# EAGLE schematic emonVs.voltage_sensor_3-wire_220V_DRAFT_EXAMPLE (EAGLE 8.2.2)
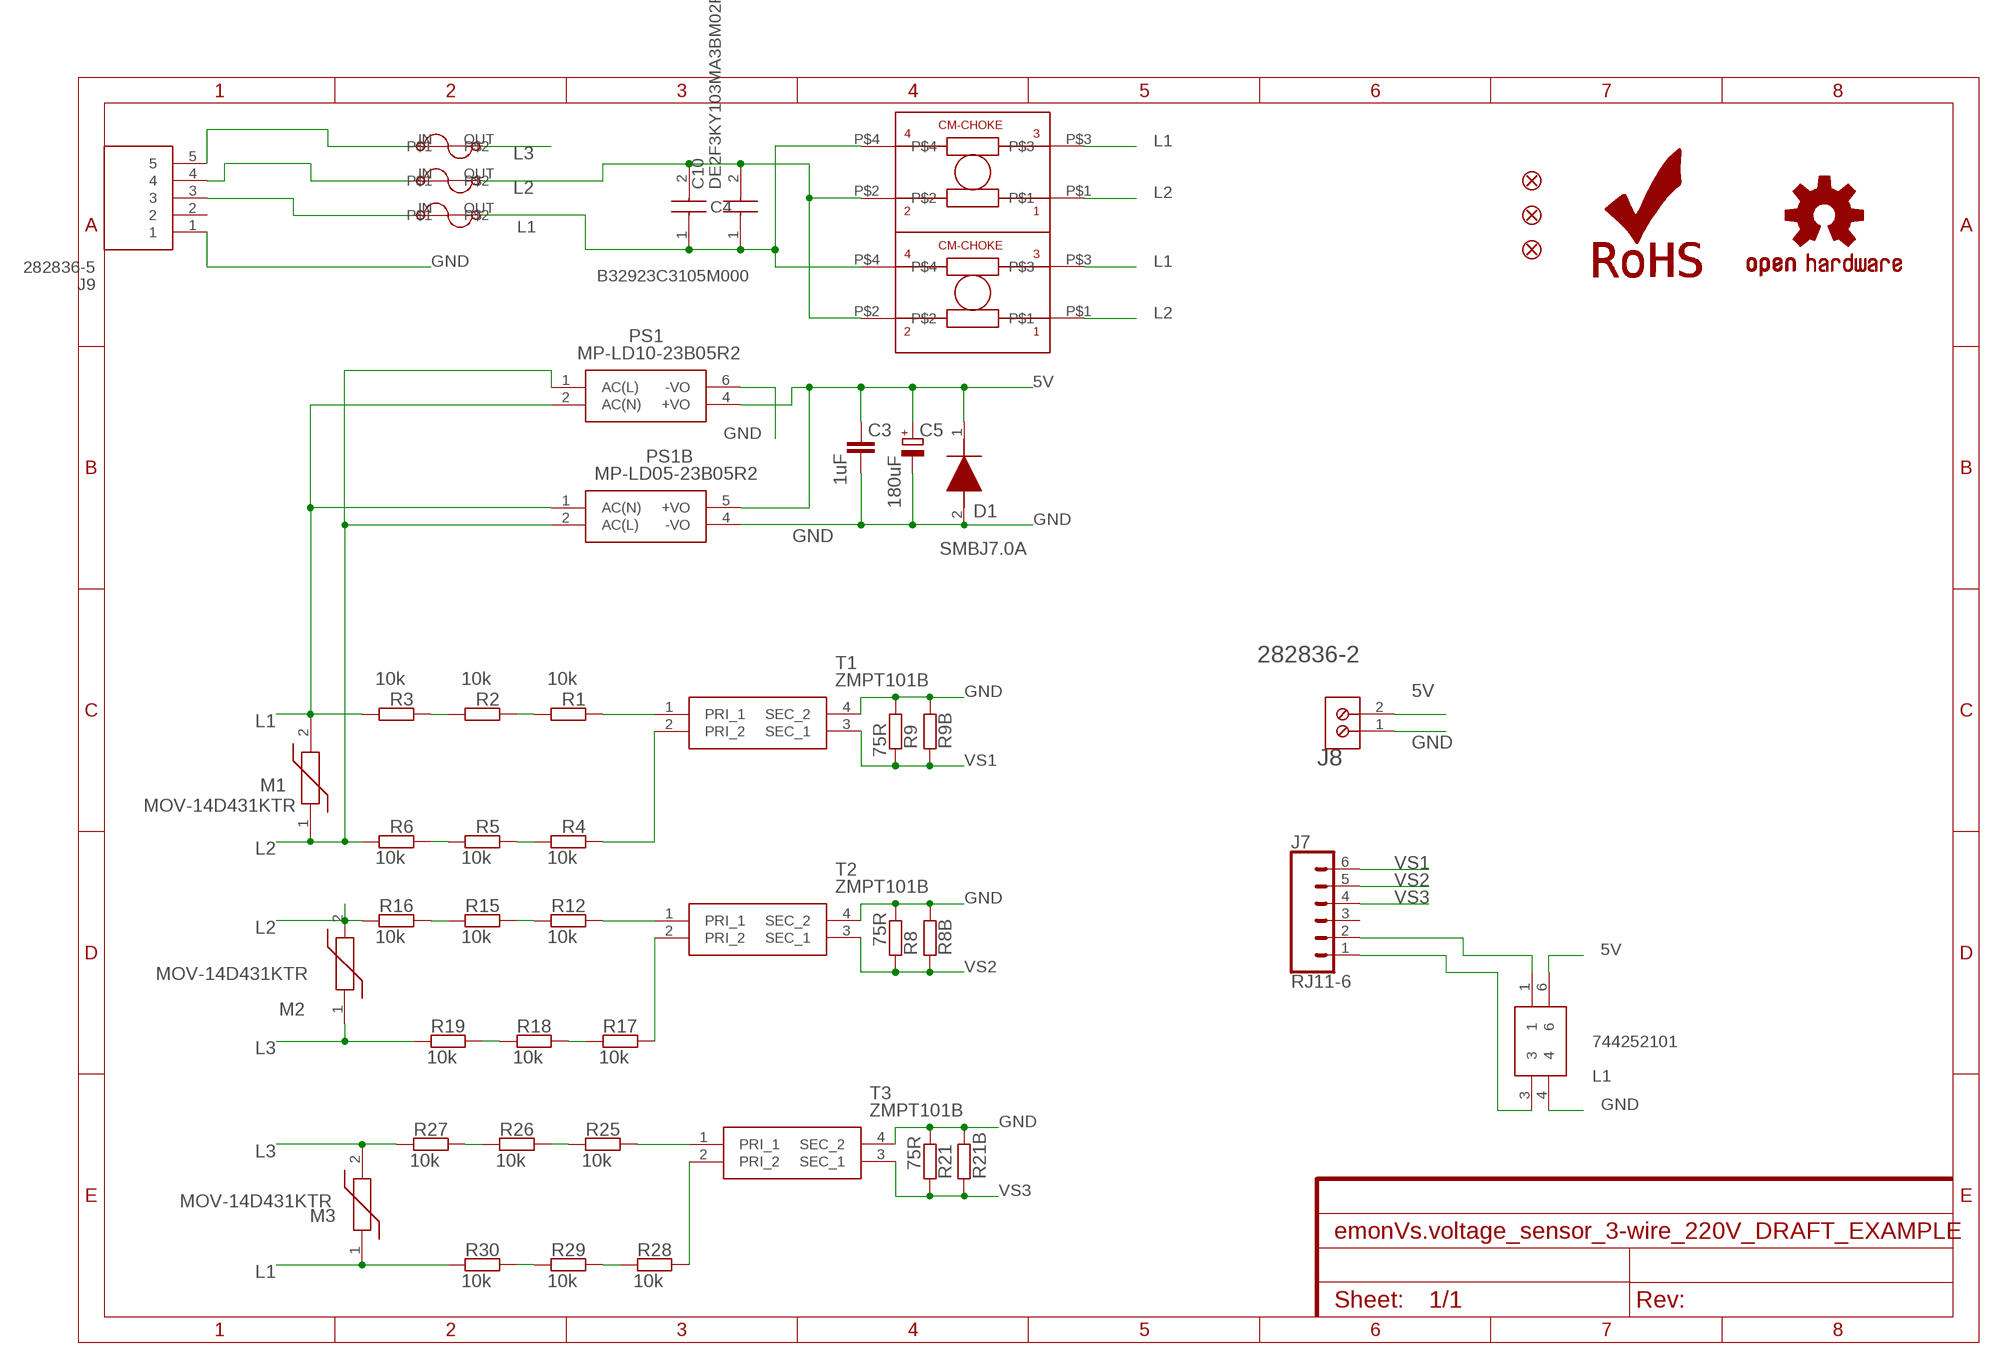
[diagram p0: schematic, sheet 1]

## Parts
C3  1uF  C-EUC0603  [C0603]
C4  B32923C3105M000  [B32923C_(26.5_X_12)]
C5  180uF  CPOL-EUC  [PANASONIC_C]
C10  DE2F3KY103MA3BM02F  [DE2F3KY103MA3BM02F]
D1  SMBJ7.0A  [DIOM5336X244N]
F1  2A/250V  BEL1AFUSE  [BELFUSE1A]
F2  2A/250V  BEL1AFUSE  [BELFUSE1A]
F3  2A/250V  BEL1AFUSE  [BELFUSE1A]
FD1  FIDUCIAL1X2  [FIDUCIAL-1X2]
FD2  FIDUCIAL1X2  [FIDUCIAL-1X2]
FD3  FIDUCIAL1X2  [FIDUCIAL-1X2]
J7  RJ11-6  [RJ11-6]
J8  TE_CONNECTIVITY_282836-2TE_CONNECTIVITY_282836-2_0_0  [TE_CONNECTIVITY_282836-2_0]
J9  282836-5  [2828365]
L1  744252101  [744252101]
LOGO1  ROHS_LOGO  [ROHS_LOGO_0.18_IN]
LOGO2  OSHW-LOGOS-COPPER  [OSHW-LOGO-S_COPPER]
M1  MOV-14D431KTR  [MOV14D431KTR]
M2  MOV-14D431KTR  [MOV14D431KTR]
M3  MOV-14D431KTR  [MOV14D431KTR]
PS1  MP-LD10-23B05R2  MP-LD10-23B12R2  [MPLD1023B12R2]
PS1B  MP-LD05-23B05R2  MP-LD05-23B03R2  [MPLD0523B03R2]
R1  10k  R-EU_R0603  [R0603]
R2  10k  R-EU_R0603  [R0603]
R3  10k  R-EU_R0603  [R0603]
R4  10k  R-EU_R0603  [R0603]
R5  10k  R-EU_R0603  [R0603]
R6  10k  R-EU_R0603  [R0603]
R8  75R  R-EU_R0603  [R0603]
R8B  R-EU_0204/7  [0204/7]
R9  75R  R-EU_R0603  [R0603]
R9B  R-EU_0204/7  [0204/7]
R12  10k  R-EU_R0603  [R0603]
R15  10k  R-EU_R0603  [R0603]
R16  10k  R-EU_R0603  [R0603]
R17  10k  R-EU_R0603  [R0603]
R18  10k  R-EU_R0603  [R0603]
R19  10k  R-EU_R0603  [R0603]
R21  75R  R-EU_R0603  [R0603]
R21B  R-EU_0204/7  [0204/7]
R25  10k  R-EU_R0603  [R0603]
R26  10k  R-EU_R0603  [R0603]
R27  10k  R-EU_R0603  [R0603]
R28  10k  R-EU_R0603  [R0603]
R29  10k  R-EU_R0603  [R0603]
R30  10k  R-EU_R0603  [R0603]
T1  ZMPT101B  [ZMPT101B]
T2  ZMPT101B  [ZMPT101B]
T3  ZMPT101B  [ZMPT101B]
U$1  47mH  RN114-0.3-02-47M  [RN114-0.3-02-47M]
U$1B  RN214-0.3-02-47M  [RN214-0.3-02-47M]

## Nets
5V: C3.1 C5.+ D1.1(K) J8.2 L1.6 PS1.4(+VO) PS1B.5(+VO)
GND: C3.2 C5.- D1.2(A) J8.1 J9.1 L1.4 PS1.6(-VO) PS1B.4(-VO) R8.2 R8B.2 R9.2 R9B.2 R21.2 R21B.2 T1.4(SEC_2) T2.4(SEC_2) T3.4(SEC_2)
L1: C4.1 C10.1 F1.OUT M1.2 M3.1 PS1.2(AC(N)) PS1B.1(AC(N)) R3.2 R30.2 U$1.P$3 U$1.P$4 U$1B.P$3 U$1B.P$4
L2: F2.OUT M1.1 M2.2 PS1.1(AC(L)) PS1B.2(AC(L)) R6.2 R16.2 U$1.P$1 U$1B.P$1
L3: F3.OUT M2.1 M3.2 R19.2 R27.2
N$1: R1.1 T1.1(PRI_1)
N$2: R4.1 T1.2(PRI_2)
N$3: R1.2 R2.1
N$4: R4.2 R5.1
N$5: R5.2 R6.1
N$6: R2.2 R3.1
N$7: F1.IN J9.3
N$8: F2.IN J9.4
N$10: R12.1 T2.1(PRI_1)
N$11: R17.1 T2.2(PRI_2)
N$12: R12.2 R15.1
N$13: R17.2 R18.1
N$14: R18.2 R19.1
N$15: R15.2 R16.1
N$16: F3.IN J9.5
N$18: J7.2 L1.1
N$19: R25.1 T3.1(PRI_1)
N$20: R28.1 T3.2(PRI_2)
N$21: R25.2 R26.1
N$22: R28.2 R29.1
N$23: R29.2 R30.1
N$24: R26.2 R27.1
N$27: J7.1 L1.3
N$29: C4.2 C10.2 U$1.P$2 U$1B.P$2
VS1: J7.6 R9.1 R9B.1 T1.3(SEC_1)
VS2: J7.5 R8.1 R8B.1 T2.3(SEC_1)
VS3: J7.4 R21.1 R21B.1 T3.3(SEC_1)
Unconnected: J7.3 J9.2

## Library data of the parts
C3 = resistor:C-EU: CAPACITOR, European symbol
C4 = B32923C3105M000:B32923C3105M000: EPCOS - B32923C3105M000 - Safety Capacitor, 1 ?F, X2, B32923C Series, 305 V, Metallized PP Source: Datasheet <https://product.tdk.com/system/files/dam/doc/product/capacitor/film/emi/data_sheet/20/20/db/fc_2009/x2_b32921_928.pdf>; ARROW_PART_NUMBER: B32923C3105M000; ARROW_PRICE-STOCK: https://www.arrow.com/en/products/b32923c3105m000/epcos-tdk; DESCRIPTION: EPCOS - B32923C3105M000 - Safety Capacitor, 1 ?F, X2, B32923C Series, 305 V, Metallized PP; HEIGHT: mm; MANUFACTURER_NAME: TDK; MANUFACTURER_PART_NUMBER: B32923C3105M000
C5 = rcl:CPOL-EU: POLARIZED CAPACITOR, European symbol; SPICEPREFIX: C
C10 = DE2F3KY103MA3BM02F:DE2F3KY103MA3BM02F: Murata Single Layer Ceramic Capacitor SLCC 10nF 250Vrms +/-20% F Dielectric DE2 Series +85C Max Op. Temp. Source: Datasheet <https://psearch.en.murata.com/capacitor/product/DE2F3KY103MA3BM02F.html>; ARROW_PART_NUMBER: DE2F3KY103MA3BM02F; ARROW_PRICE-STOCK: https://www.arrow.com/en/products/de2f3ky103ma3bm02f/murata-manufacturing; DESCRIPTION: Murata Single Layer Ceramic Capacitor SLCC 10nF 250Vrms +/-20% F Dielectric DE2 Series +85C Max Op. Temp.; HEIGHT: 17mm; MANUFACTURER_NAME: Murata Electronics; MANUFACTURER_PART_NUMBER: DE2F3KY103MA3BM02F; MOUSER_PART_NUMBER: 81-DE2F3KY103MA3BM2F; MOUSER_PRICE-STOCK: https://www.mouser.co.uk/ProductDetail/Murata-Electronics/DE2F3KY103MA3BM02F?qs=coxMWmu44UCpS%2FqDCKay7w%3D%3D
D1 = SMBJ7.0A:SMBJ7.0A: TVS, SMD, 600W, 7V HY Electronic Corp SMBJ7.0A Uni-Directional TVS Diode, 600 (Min.)W peak, 2-Pin SMB Source: Datasheet; DESCRIPTION: TVS, SMD, 600W, 7V HY Electronic Corp SMBJ7.0A Uni-Directional TVS Diode, 600 (Min.)W peak, 2-Pin SMB; HEIGHT: 2.44mm; MANUFACTURER_NAME: HY Electronic Corp; MANUFACTURER_PART_NUMBER: SMBJ7.0A
F1-F3 = Qxd:BEL1AFUSE
FD1-FD3 = SparkFun-Aesthetics:FIDUCIAL: Fiducial Alignment Points Point-of-reference for pick-and-place machines and other optical instruments.
J7 = SparkFun-Connectors:RJ11-6: RJ11 Jack - 6 pin Commonly found on CAT3 devices and some Microchip programmers. Here is the connector we sell at SparkFun: RJ11 6-Pin Connector <https://www.sparkfun.com/products/132> (PRT-00132) Datasheet <http://www.sparkfun.com/datasheets/Prototyping/Connectors/RJ11-Datasheet.pdf> It is used on this SparkFun product: SparkFun Weather Shield <https://www.sparkfun.com/products/12081> (DEV-12081) Weather Meters <https://www.sparkfun.com/products/8942> (SEN-08942); PROD_ID: CONN-08590; SF_ID: PRT-00132; VALUE: RJ11
J8 = TE Connectivity - 282836-2:TE_CONNECTIVITY_282836-2: CN-1P-F-TB2; 3D_MODEL: 282836-2.pdf; CATEGORY: Connectors,Interconnects; CIIVA_IDS: 751464; CLAMP_MATERIAL___PLATING: Brass-NickelPlated; COLOR: Green; CONTACT_MATERIAL___PLATING: Brass-TinPlated; CURRENT: 13.5A; DATASHEET_URL: http://www.te.com.cn/commerce/DocumentDelivery/DDEController?Action=showdoc&DocId=Catalog+Section%7F1308389_EUROSTYLE_TERMINAL_BLOCKS%7F0607%7Fpdf%7FEnglish%7FENG_CS_1308389_EUROSTYLE_TERMINAL_BLOCKS_0607.pdf%7F282836-2; DYNAMIC_CATALOG: BuchananSeries; FAMILY: TerminalBlocks-WiretoBoard; FEATURED_PRODUCT: EurostyleTerminalBlockConnectors; FEATURES: Interlocking(Side); FOOTPRINT_VARIANT_NAME_0: Manufacturer Recommended; HOUSING_MATERIAL: Polyamide(PA66),Nylon6/6; IMPORTED: yes; IMPORTED_FROM: vault; IMPORT_TS: 1521863485; MANUFACTURER_URL: http://www.te.com; MATING_ORIENTATION: HorizontalwithBoard; MF: TE Connectivity; MOUNTING_TYPE: ThroughHole; MPN: 282836-2; NUMBER_OF_LEVELS: 1; OTHER_NAMES: 5ULV-02BA98076; PACKAGE_DESCRIPTION: Female Header, Pitch 5 mm, 1 x 2 Position, Height 10 mm, Tail Length 3.5 mm; PACKAGE_REFERENCE: THD; PACKAGING: Bulk; PITCH: 0.197"(5.00mm); POSITIONS_PER_LEVEL: 2; PREFIX: J; PRODUCT_TRAINING_MODULES: Wire-to-BoardEurostyleTerminalBlocks; RELEASE_DATE: 1509504648; ROHS_INFORMATION: 282836-2StatementofCompliance; SCREW_MATERIAL___PLATING: Brass-NickelPlated; SCREW_THREAD: M3; SERIES: Buchanan; STANDARD_PACKAGE: 300; TORQUE___SCREW: 0.68Nm(6Lb-In); VAULT_GUID: C9495783-FFFC-46B6-B95E-4CE97DFAD08E; VAULT_REVISION: DF47BFDD-E559-4BFA-862A-02055DA5A464; VOLTAGE: 300V; WIRE_GAUGE: 16-30AWG; WIRE_TERMINATION: Screw-RisingCageClamp
J9 = 282836-5:282836-5: TERMI-BLOK PCB MOUNT 90 5P. Source: Datasheet <https://www.te.com/commerce/DocumentDelivery/DDEController?Action=srchrtrv&DocNm=1-1773458-1_EURO_STYLE_QRG&DocType=Data Sheet&DocLang=English&PartCntxt=282836-5&DocFormat=pdf>; ARROW_PART_NUMBER: 282836-5; ARROW_PRICE-STOCK: https://www.arrow.com/en/products/282836-5/te-connectivity?region=nac; DESCRIPTION: TERMI-BLOK PCB MOUNT 90 5P.; HEIGHT: 10.2mm; MANUFACTURER_NAME: TE Connectivity; MANUFACTURER_PART_NUMBER: 282836-5; MOUSER_PART_NUMBER: 571-2828365; MOUSER_PRICE-STOCK: https://www.mouser.co.uk/ProductDetail/TE-Connectivity/282836-5?qs=A%252Bip%252BNCYi6PWM9nOrDokEg%3D%3D
L1 = 744252101:744252101: Common Mode Choke WE-SL3 2x100uH 0.5A Wurth WE-SL3 Series Wire-wound SMD Inductor with a Ferrite Core, 100 uH +50/-30 Bifilar Winding 500mA Idc Source: Datasheet <https://datasheet.datasheetarchive.com/originals/distributors/Datasheets_SAMA/813b8c68731e2e4ca9c504a5a5705204.pdf>; DESCRIPTION: Common Mode Choke WE-SL3 2x100uH 0.5A Wurth WE-SL3 Series Wire-wound SMD Inductor with a Ferrite Core, 100 uH +50/-30 Bifilar Winding 500mA Idc; HEIGHT: 2.5mm; MANUFACTURER_NAME: Wurth Elektronik; MANUFACTURER_PART_NUMBER: 744252101; MOUSER_PART_NUMBER: 710-744252101; MOUSER_PRICE-STOCK: https://www.mouser.co.uk/ProductDetail/Wurth-Elektronik/744252101?qs=T3oQrply3y%2FhsB6zILUctg%3D%3D
LOGO1 = SparkFun-Aesthetics:ROHS_LOGO: Restriction of Hazardous Substances (RoHS) Logo Logo for RoHS-certified hardware.
LOGO2 = SparkFun-Aesthetics:OSHW-LOGO: Open-Source Hardware (OSHW) Logo This logo indicates the piece of hardware it is found on incorporates a OSHW license and/or adheres to the definition of open source hardware found here: http://freedomdefined.org/OSHW
M1-M3 = MOV-14D431KTR:MOV-14D431KTR: Var MOV 275VAC/350VDC 4500A 430V Thru-Hole Radial T/R Source: Datasheet <https://componentsearchengine.com/Datasheets/2/MOV-14D431KTR.pdf>; ARROW_PART_NUMBER: MOV-14D431KTR; ARROW_PRICE-STOCK: https://www.arrow.com/en/products/mov-14d431ktr/bourns; DESCRIPTION: Var MOV 275VAC/350VDC 4500A 430V Thru-Hole Radial T/R; HEIGHT: 20mm; MANUFACTURER_NAME: Bourns; MANUFACTURER_PART_NUMBER: MOV-14D431KTR; MOUSER_PART_NUMBER: 652-MOV-14D431KTR; MOUSER_PRICE-STOCK: https://www.mouser.co.uk/ProductDetail/Bourns/MOV-14D431KTR?qs=CQ3B1E%252BbPs0ZvUvqcBsPRw%3D%3D
PS1 = MP-LD10-23B12R2:MP-LD10-23B12R2: MULTICOMP PRO - MP-LD10-23B05R2 - AC/DC PCB Mount Power Supply (PSU), 100 to 430VDC, ITE, Household, Medical & Transformers, 5V Output Source: Datasheet <https://componentsearchengine.com/Datasheets/2/MP-LD10-23B05R2.pdf>; DESCRIPTION: MULTICOMP PRO - MP-LD10-23B12R2 - AC/DC PCB Mount Power Supply (PSU), 100 to 430VDC, ITE, Household, Medical & Transformers, 1 Output; HEIGHT: 21.5mm; MANUFACTURER_NAME: MULTICOMP; MANUFACTURER_PART_NUMBER: MP-LD10-23B05R2
PS1B = MP-LD05-23B03R2:MP-LD05-23B03R2: POWER SUPPLY, AC-DC, 3.3V, 1.515A Source: Datasheet <https://www.farnell.com/datasheets/3167202.pdf>; DESCRIPTION: POWER SUPPLY, AC-DC, 3.3V, 1.515A; HEIGHT: 18.1mm; MANUFACTURER_NAME: MULTICOMP; MANUFACTURER_PART_NUMBER: MP-LD05-23B03R2
R1-R6 R8 R8B R9 R9B R12 R15-R19 R21 R21B R25-R30 = rcl:R-EU_: RESISTOR, European symbol
T1-T3 = ZMPT101B:ZMPT101B: Current-type Voltage Transformer Source: Datasheet; DESCRIPTION: Current-type Voltage Transformer; HEIGHT: 18.8mm; MANUFACTURER_NAME: Qingxian Zeming Langxi Electronic; MANUFACTURER_PART_NUMBER: ZMPT101B
U$1 = Schaffner-CM-Choke:RN114-0.3-02-47M
U$1B = Schaffner-CM-Choke:RN214-0.3-02-47M

## Net classes
0 default: clearance 0.205 mm
1 power: width 0.305 mm, drill 0.6 mm, clearance 0.254 mm
2 gnd: width 0.254 mm, drill 0.6 mm, clearance 0.254 mm